# EAGLE design cont (EAGLE 9.3.0)
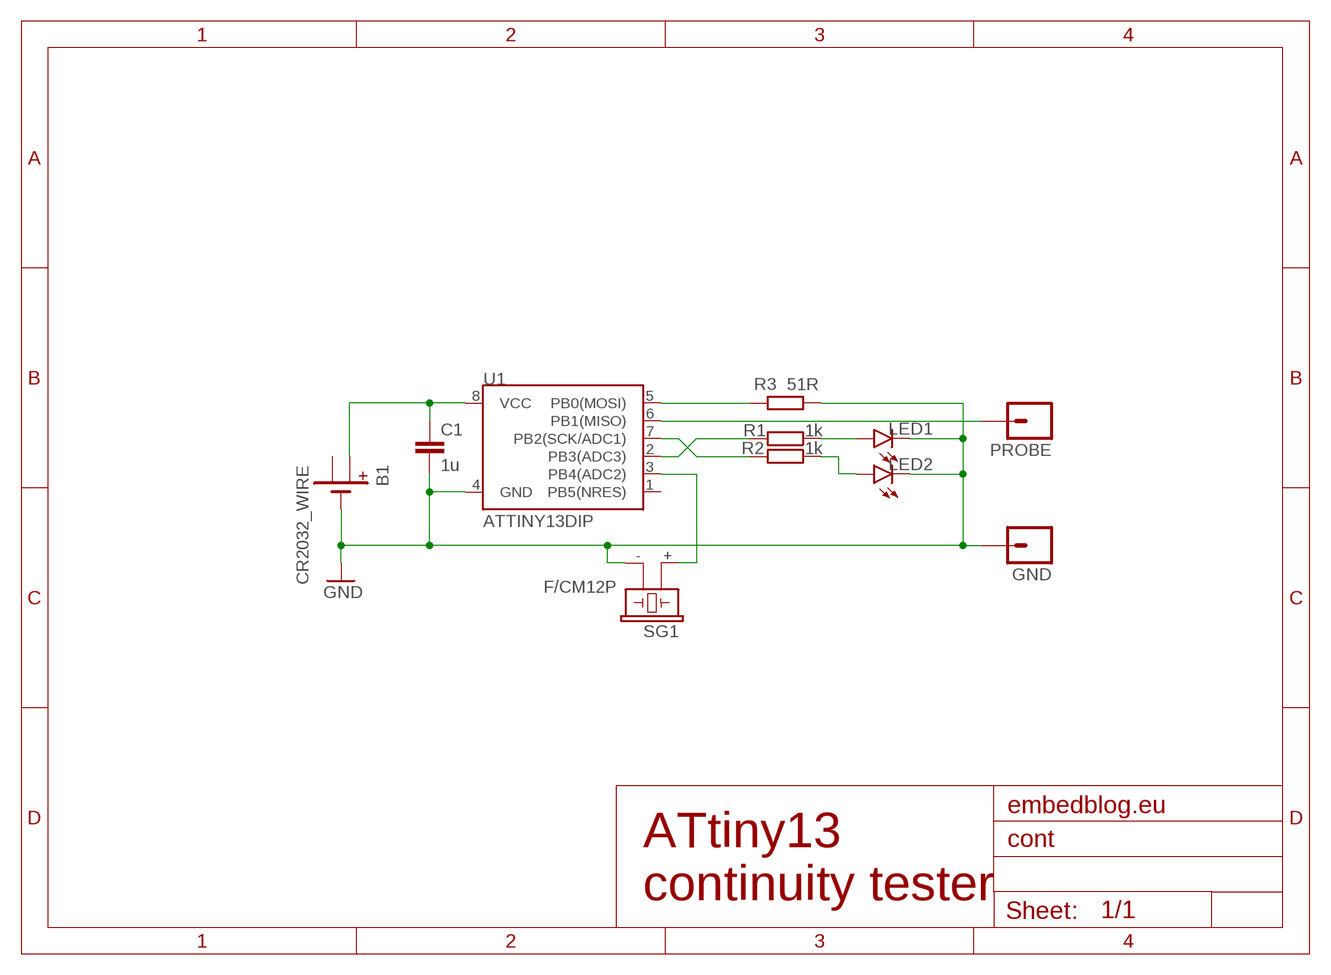
[diagram p0: schematic, sheet 1]

## Parts
B1  CR2032_WIRE  [CR2032]
C1  1u  C-EUC1206  [C1206]
GND  M01OFFSET  [1X01_OFFSET]
LED1  LEDSML1206  [SML1206]
LED2  LEDSML1206  [SML1206]
PROBE  M01OFFSET  [1X01_OFFSET]
R1  1k  R-EU_R1206  [R1206]
R2  1k  R-EU_R1206  [R1206]
R3  51R  R-EU_R1206  [R1206]
SG1  F/CM12P  [F/CM12P]
U1  ATTINY13DIP  [DIP08]

## Nets
GND: B1.MINUS(-) C1.2 GND.1 LED1.C LED2.C R3.1 SG1.- U1.4(GND)
N$1: B1.PLUS1(+1) C1.1 U1.8(VCC)
N$3: R1.2 U1.2(PB3(ADC3))
N$4: LED1.A R1.1
N$5: R2.2 U1.7(PB2(SCK/ADC1))
N$7: LED2.A R2.1
N$8: R3.2 U1.5(PB0(MOSI))
N$10: PROBE.1 U1.6(PB1(MISO))
N$12: SG1.+ U1.3(PB4(ADC2))
Unconnected: B1.PLUS2(+2) U1.1(PB5(NRES))

## Notes on the sheet
- embedblog.eu
- ATtiny13 
  continuity tester

## Library data of the parts
B1 = custom:CR2032_WIRE
C1 = resistor:C-EU: CAPACITOR, European symbol
GND PROBE = SparkFun-Connectors:M01: Header 1 Standard 1-pin 0.1" header. Use with straight break away headers (SKU : PRT-00116), right angle break away headers (PRT-00553), swiss pins (PRT-00743), machine pins (PRT-00117), and female headers (PRT-00115). SMTSO-256-ET is a "flush mount" nut for a 4-40 screw. The older package used to be too tight, and did not allow it to sit properly thru the drill hit. The latest (0.165DIA) fits nice and snug.
LED1 LED2 = led:LED: LED OSRAM: - CHIPLED LG R971, LG N971, LY N971, LG Q971, LY Q971, LO R971, LY R971 LH N974, LH R974 LS Q976, LO Q976, LY Q976 LO Q996 - Hyper CHIPLED LW Q18S LB Q993, LB Q99A, LB R99A - SideLED LS A670, LO A670, LY A670, LG A670, LP A670 LB A673, LV A673, LT A673, LW A673 LH A674 LY A675 LS A676, LA A676, LO A676, LY A676, LW A676 LS A679, LY A679, LG A679 - Hyper Micro SIDELED® LS Y876, LA Y876, LO Y876, LY Y876 LT Y87S - SmartLED LW L88C, LW L88S LB L89C, LB L89S, LG L890 LS L89K, LO L89K, LY L89K LS L896, LA L896, LO L896, LY L896 - TOPLED LS T670, LO T670, LY T670, LG T670, LP T670 LSG T670, LSP T670, LSY T670, LOP T670, LYG T670 LG T671, LOG T671, LSG T671 LB T673, LV T673, LT T673, LW T673 LH T674 LS T676, LA T676, LO T676, LY T676, LB T676, LH T676, LSB T676, LW T676 LB T67C, LV T67C, LT T67C, LS T67K, LO T67K, LY T67K, LW E67C LS E67B, LA E67B, LO E67B, LY E67B, LB E67C, LV E67C, LT E67C LW T67C LS T679, LY T679, LG T679 LS T770, LO T770, LY T770, LG T770, LP T770 LB T773, LV T773, LT T773, LW T773 LH T774 LS E675, LA E675, LY E675, LS T675 LS T776, LA T776, LO T776, LY T776, LB T776 LHGB T686 LT T68C, LB T68C - Hyper Mini TOPLED® LB M676 - Mini TOPLED Santana® LG M470 LS M47K, LO M47K, LY M47K Source: http://www.osram.convergy.de LUXEON: - LUMILED® LXK2-PW12-R00, LXK2-PW12-S00, LXK2-PW14-U00, LXK2-PW14-V00 LXK2-PM12-R00, LXK2-PM12-S00, LXK2-PM14-U00 LXK2-PE12-Q00, LXK2-PE12-R00, LXK2-PE12-S00, LXK2-PE14-T00, LXK2-PE14-U00 LXK2-PB12-K00, LXK2-PB12-L00, LXK2-PB12-M00, LXK2-PB14-N00, LXK2-PB14-P00, LXK2-PB14-Q00 LXK2-PR12-L00, LXK2-PR12-M00, LXK2-PR14-Q00, LXK2-PR14-R00 LXK2-PD12-Q00, LXK2-PD12-R00, LXK2-PD12-S00 LXK2-PH12-R00, LXK2-PH12-S00 LXK2-PL12-P00, LXK2-PL12-Q00, LXK2-PL12-R00 Source: www.luxeon.com KINGBRIGHT: KA-3528ASYC Source: www.kingbright.com
R1-R3 = resistor:R-EU_: RESISTOR, European symbol
SG1 = buzzer:F/CM12P: BUZZER Source: Buerklin; OC_FARNELL: unknown; OC_NEWARK: unknown
U1 = SparkFun-DigitalIC:ATTINY13: Atmel 8-pin 1kB flash uC

## Board
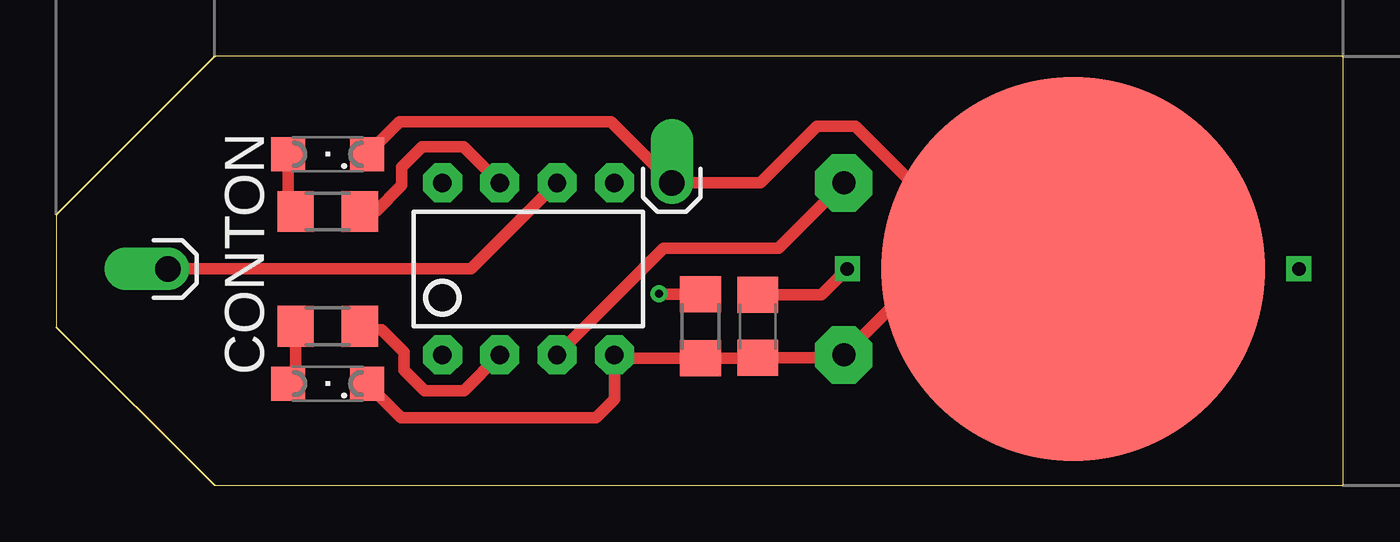
[diagram p1: board, top side]
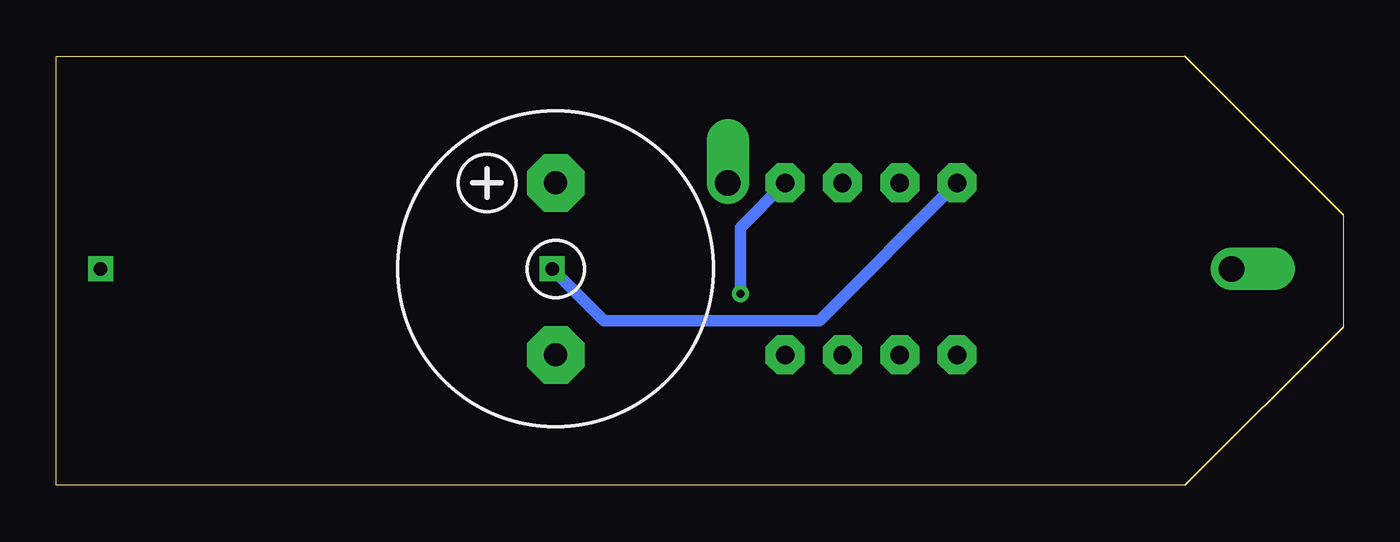
[diagram p2: board, bottom side, seen from below]

Size 57 x 19 mm. Coordinates in mm from the lower left corner, seen from the top.
Outline: 7,0 57,0 57,19 7,19 0,12 0,7 7,0
Copper layers (1*16): Top 0.035mm / dielectric 1.5mm / Bottom 0.035mm
Design rules "default": minimum track width 6mil, minimum drill 0.35mm, track to track 6mil, track to pad 6mil, pad to pad 6mil, via to via 6mil, smd to smd 6mil, copper to edge 40mil, drill to drill 6mil, minimum pad ring 10mil, minimum via ring 8mil, stop-mask expansion 4mil, vias tented up to drill 0mil, thermal gap 10mil

### Footprints (pad centres in the part's own frame; a part is rotated, then mirrored left to right if it is on the bottom)
CR2032 = smd 17 x 17: MINUS 0,0 | drill 0.6 square: PLUS1 -10,0; PLUS2 10,0
C1206 = smd 1.6 x 1.8: 1 -1.4,0; 2 1.4,0
1X01_OFFSET = drill 1.118 pad 1.88 offset: 1 0,0
SML1206 = smd 1.5 x 1.5: A 1.75,0; C -1.75,0
R1206 = smd 1.6 x 1.803: 1 -1.422,0; 2 1.422,0
F/CM12P = drill 1.016 pad 2.54 octagon: + 3.81,0; - -3.81,0
DIP08 = drill 0.813 pad 1.727 octagon: 1 -3.81,-3.81; 2 -1.27,-3.81; 3 1.27,-3.81; 4 3.81,-3.81; 5 3.81,3.81; 6 1.27,3.81; 7 -1.27,3.81; 8 -3.81,3.81

### Placement (x,y rotation side)
B1  45.04,9.59 0 top
C1  31.07,7.05 270 top
GND  27.26,13.4 0 top
LED1  12.02,4.51 180 top
LED2  12.02,14.67 180 top
PROBE  4.94,9.59 90 top
R1  12.02,7.05 0 top
R2  12.02,12.13 0 top
R3  28.53,7.05 90 top
SG1  34.88,9.59 90 bottom
U1  20.91,9.59 0 top

### Tracks (layer width: path | path; a pad name or v marks a point on that pad's centre or on a via)
GND
  Top 0.508: LED1.C 15.28,3 23.9,3 24.72,3.82 U1.4 24.87,5.63 R3.1 31.05,5.63 C1.2 34.75,5.65 SG1.- 38.69,9.59 39.1,9.59 | 39.1,9.59 B1.MINUS | 39.1,9.59 39.4,9.89 39.4,11.9 35.4,15.9 33.7,15.9 31.2,13.4 GND.1 24.56,16.1 15.2,16.1 LED2.C
N$1
  Top 0.508: B1.PLUS1 33.9,8.45 C1.1
  Bottom 0.508: U1.8 23.2,7.3 32.75,7.3 B1.PLUS1
N$3
  Top 0.508: R1.2 13.59,6.9 14.4,6.9 15.4,5.9 15.4,5.1 16.3,4.2 18.06,4.2 U1.2
N$4
  Top 0.508: R1.1 10.6,4.84 LED1.A
N$5
  Top 0.508: R2.2 14.13,12.13 15.3,13.3 15.3,14.1 16.2,15 18.04,15 U1.7
N$7
  Top 0.508: LED2.A 10.27,12.46 R2.1
N$8  (via drill 0.35)
  Top 0.508: R3.2 26.73,8.47 v26.7,8.5
  Bottom 0.508: v26.7,8.5 26.7,11.42 U1.5
N$10
  Top 0.508: PROBE.1 18.37,9.59 U1.6
N$12
  Top 0.508: U1.3 26.9,10.5 31.98,10.5 SG1.+

### Text on the board
tPlace: ON | CONT